# EAGLE design bottom-r1 (EAGLE 7.6.0)
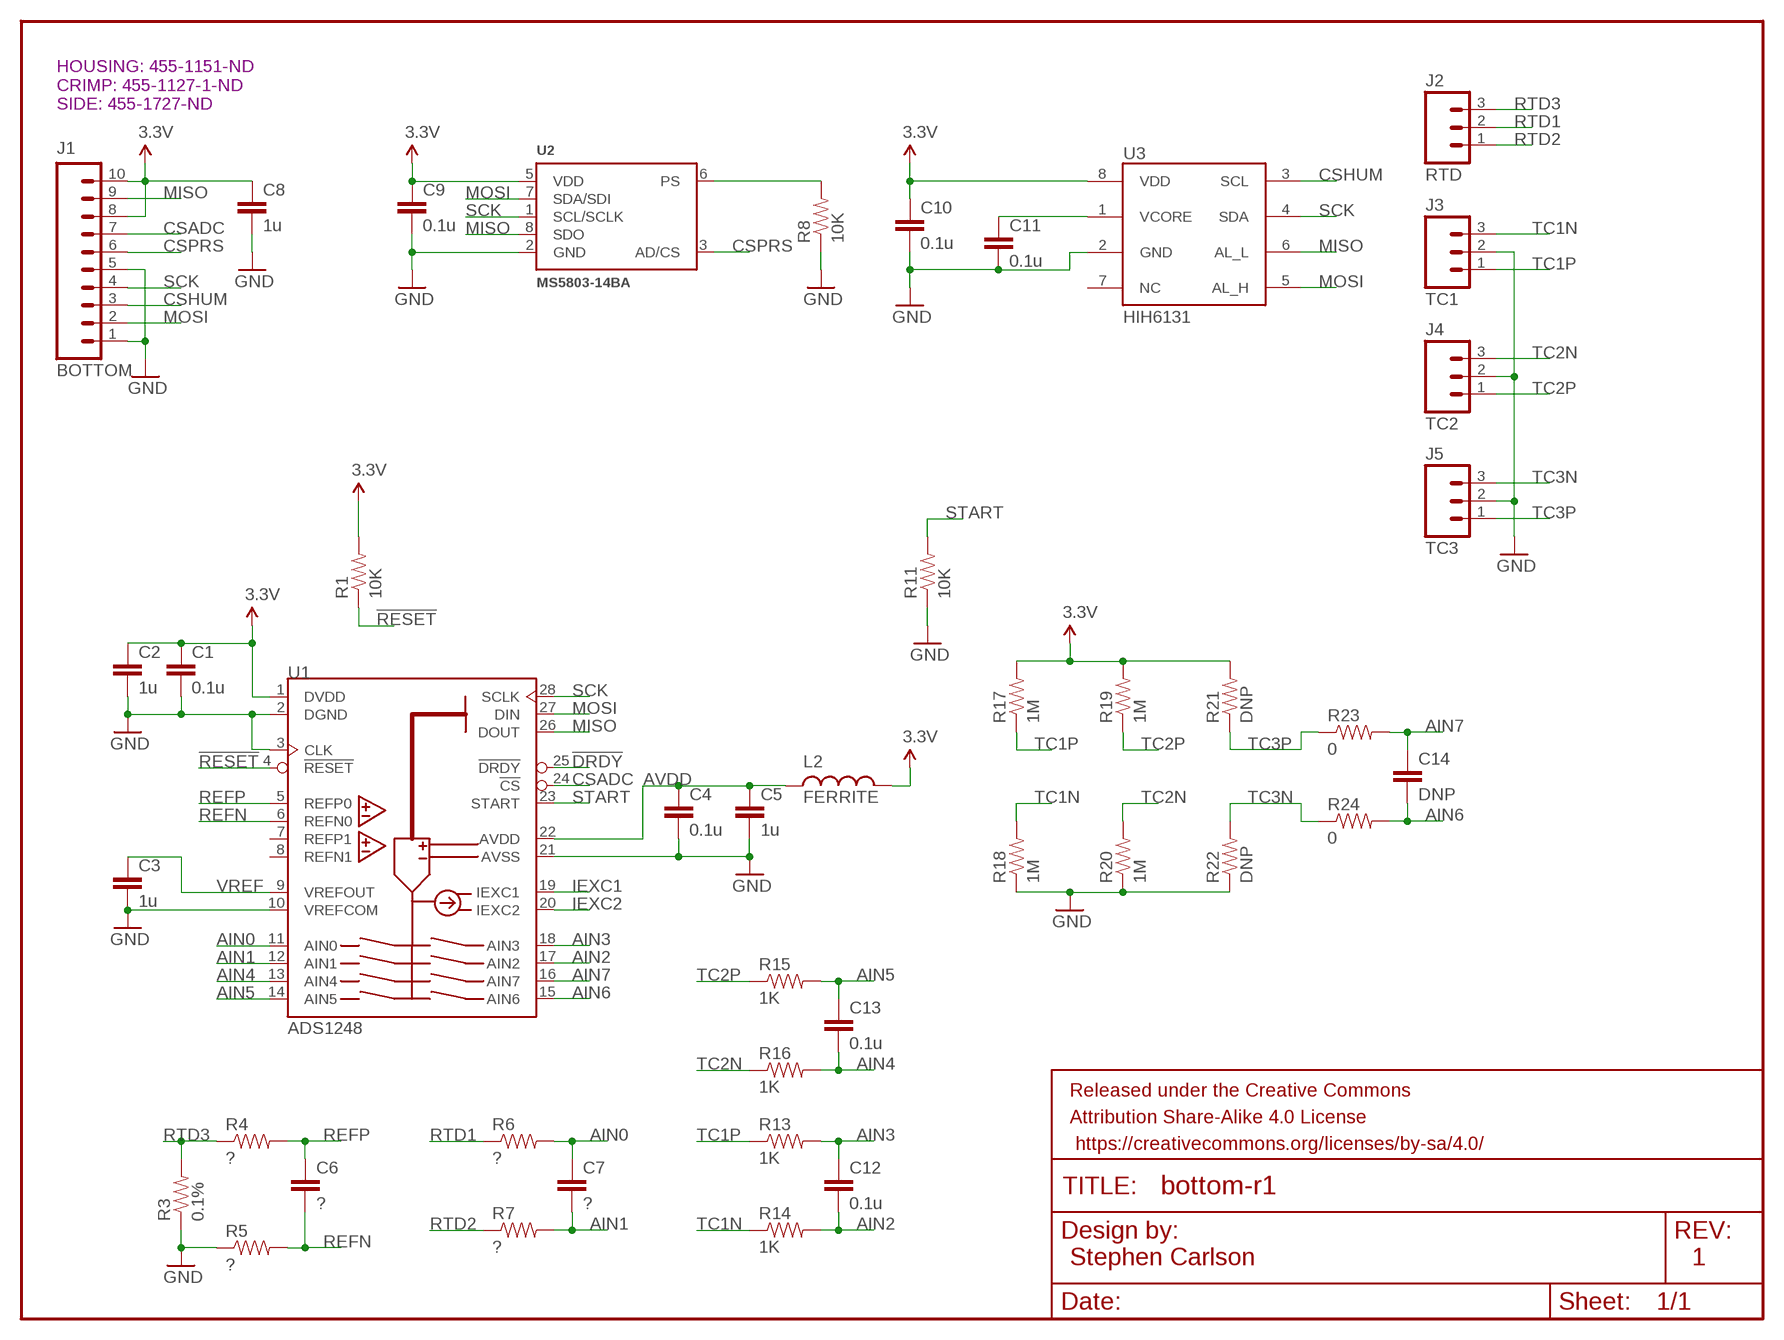
[diagram p0: schematic, sheet 1]

## Parts
C1  0.1u  CAP0805  [0805]
C2  1u  CAP0805  [0805]
C3  1u  CAP0805  [0805]
C4  0.1u  CAP0805  [0805]
C5  1u  CAP0805  [0805]
C6  ?  CAP0805  [0805]
C7  ?  CAP0805  [0805]
C8  1u  CAP0805  [0805]
C9  0.1u  CAP0805  [0805]
C10  0.1u  CAP0805  [0805]
C11  0.1u  CAP0805  [0805]
C12  0.1u  CAP0805  [0805]
C13  0.1u  CAP0805  [0805]
C14  DNP  CAP0805  [0805]
FRAME1  FRAME-LETTERNO_PACKAGE  [DUMMY]
J1  BOTTOM  M102MM  [1X10-2MM]
J2  RTD  M03JST-PTH  [JST-3-PTH]
J3  TC1  M03JST-PTH  [JST-3-PTH]
J4  TC2  M03JST-PTH  [JST-3-PTH]
J5  TC3  M03JST-PTH  [JST-3-PTH]
L2  FERRITE  INDUCTOR1206  [1206]
R1  10K  RESISTOR0805-RES  [0805]
R3  0.1%  RESISTOR0805-RES  [0805]
R4  ?  RESISTOR0805-RES  [0805]
R5  ?  RESISTOR0805-RES  [0805]
R6  ?  RESISTOR0805-RES  [0805]
R7  ?  RESISTOR0805-RES  [0805]
R8  10K  RESISTOR0805-RES  [0805]
R11  10K  RESISTOR0805-RES  [0805]
R13  1K  RESISTOR0805-RES  [0805]
R14  1K  RESISTOR0805-RES  [0805]
R15  1K  RESISTOR0805-RES  [0805]
R16  1K  RESISTOR0805-RES  [0805]
R17  1M  RESISTOR0805-RES  [0805]
R18  1M  RESISTOR0805-RES  [0805]
R19  1M  RESISTOR0805-RES  [0805]
R20  1M  RESISTOR0805-RES  [0805]
R21  DNP  RESISTOR0805-RES  [0805]
R22  DNP  RESISTOR0805-RES  [0805]
R23  0  RESISTOR0805-RES  [0805]
R24  0  RESISTOR0805-RES  [0805]
U1  ADS1248  [SO28]
U2  MS5803-14BA  [MS5803]
U3  HIH6131  [SOIC8]

## Nets
3.3V: C1.1 C2.1 C8.1 C9.1 C10.1 J1.8 J1.10 L2.2 R1.2 R17.2 R19.2 R21.2 U1.1(DVDD) U2.5(VDD) U3.8(VDD)
!DRDY!: U1.25(!DRDY!)
!RESET!: R1.1 U1.4(!RESET!)
AIN0: C7.1 R6.2 U1.11(AIN0)
AIN1: C7.2 R7.2 U1.12(AIN1)
AIN2: C12.2 R14.2 U1.17(AIN2)
AIN3: C12.1 R13.2 U1.18(AIN3)
AIN4: C13.2 R16.2 U1.13(AIN4)
AIN5: C13.1 R15.2 U1.14(AIN5)
AIN6: C14.2 R24.2 U1.15(AIN6)
AIN7: C14.1 R23.2 U1.16(AIN7)
AVDD: C4.1 C5.1 L2.1 U1.22(AVDD)
CSADC: J1.7 U1.24(!CS!)
CSHUM: J1.3 U3.3(SCL)
CSPRS: J1.6 U2.3(AD/CS)
GND: C1.2 C2.2 C3.2 C4.2 C5.2 C8.2 C9.2 C10.2 C11.2 J1.1 J1.5 J3.2 J4.2 J5.2 R3.1 R5.1 R8.1 R11.1 R18.1 R20.1 R22.1 U1.2(DGND) U1.3(CLK) U1.10(VREFCOM) U1.21(AVSS) U2.2(GND) U3.2(GND)
IEXC1: U1.19(IEXC1)
IEXC2: U1.20(IEXC2)
MISO: J1.9 U1.26(DOUT) U2.8(SDO) U3.6(AL_L)
MOSI: J1.2 U1.27(DIN) U2.7(SDA/SDI) U3.5(AL_H)
PS: R8.2 U2.6(PS)
REFN: C6.2 R5.2 U1.6(REFN0)
REFP: C6.1 R4.2 U1.5(REFP0)
RTD1: J2.2 R6.1
RTD2: J2.1 R7.1
RTD3: J2.3 R3.2 R4.1
SCK: J1.4 U1.28(SCLK) U2.1(SCL/SCLK) U3.4(SDA)
START: R11.2 U1.23(START)
TC1N: J3.3 R14.1 R18.2
TC1P: J3.1 R13.1 R17.1
TC2N: J4.3 R16.1 R20.2
TC2P: J4.1 R15.1 R19.1
TC3N: J5.3 R22.2 R24.1
TC3P: J5.1 R21.1 R23.1
VCORE: C11.1 U3.1(VCORE)
VREF: C3.1 U1.9(VREFOUT)
Unconnected: U1.7(REFP1) U1.8(REFN1) U3.7(NC)

## Notes on the sheet
- HOUSING: 455-1151-ND
  CRIMP: 455-1127-1-ND
  SIDE: 455-1727-ND
- Stephen Carlson | 1

## Library data of the parts
C1-C14 = SparkFun-Passives:CAP: Capacitor Standard 0603 ceramic capacitor, and 0.1" leaded capacitor.
FRAME1 = SparkFun-Aesthetics:FRAME-LETTER: Schematic Frame Standard 8.5x11 US Letter frame; DESIGNER: Nobody; VERSION: v01
J1 = SparkFun-Connectors:M10: Header 10 Standard 10-pin 0.1" header. Use with straight break away headers (SKU : PRT-00116), right angle break away headers (PRT-00553), swiss pins (PRT-00743), machine pins (PRT-00117), and female headers (PRT-00115).
J2-J5 = SparkFun-Connectors:M03: Header 3 Standard 3-pin 0.1" header. Use with straight break away headers (SKU : PRT-00116), right angle break away headers (PRT-00553), swiss pins (PRT-00743), machine pins (PRT-00117), and female headers (PRT-00115). Molex polarized connector foot print use with SKU : PRT-08232 with associated crimp pins and housings.; SKU: PRT-09915
L2 = HAB:INDUCTOR: INDUCTOR Standard inductor, with some new packages Why do inductors never come in standard packages!?
R1 R3-R8 R11 R13-R24 = SparkFun-Passives:RESISTOR: Resistor Basic schematic elements and footprints for 0603, 1206, and PTH resistors.
U1 = HAB:ADS1248: ADS1248 24-bit, 2-kSPS, Analog-To-Digital Converters with Programmable Gain Amplifier (PGA) for Sensor Measurement
U2 = SparkFun-Sensors:MS5803-14BA: Measurement Specialties MS5803_14BA Pressure (Depth) Sensor Datasheet: https://cdn.sparkfun.com/datasheets/Sensors/Weather/ms5803_14ba.pdf; PROD_ID: IC-12111
U3 = SparkFun-AnalogIC:HIH6131

## Board
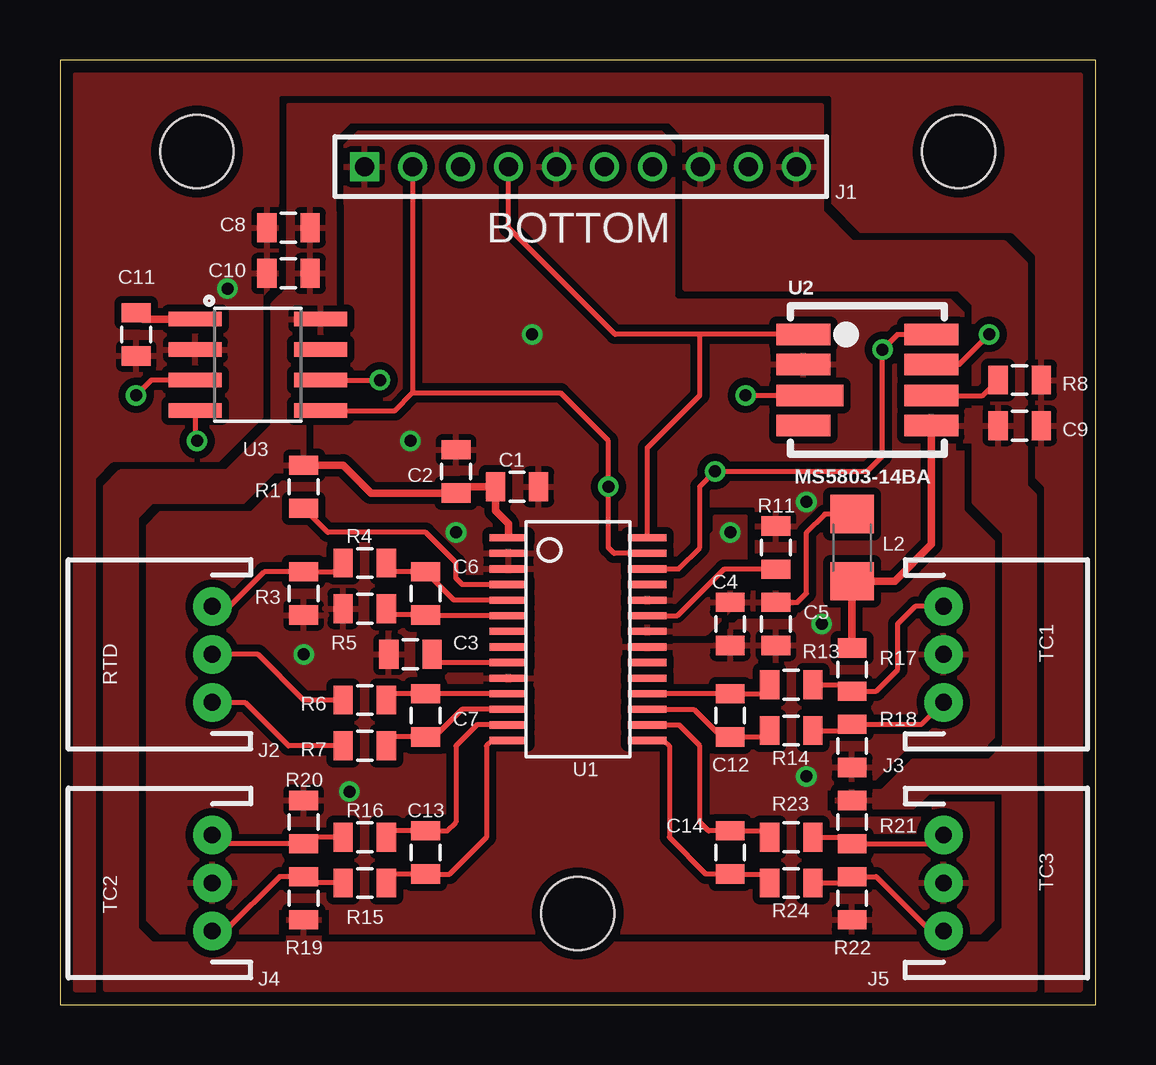
[diagram p1: board, top side]
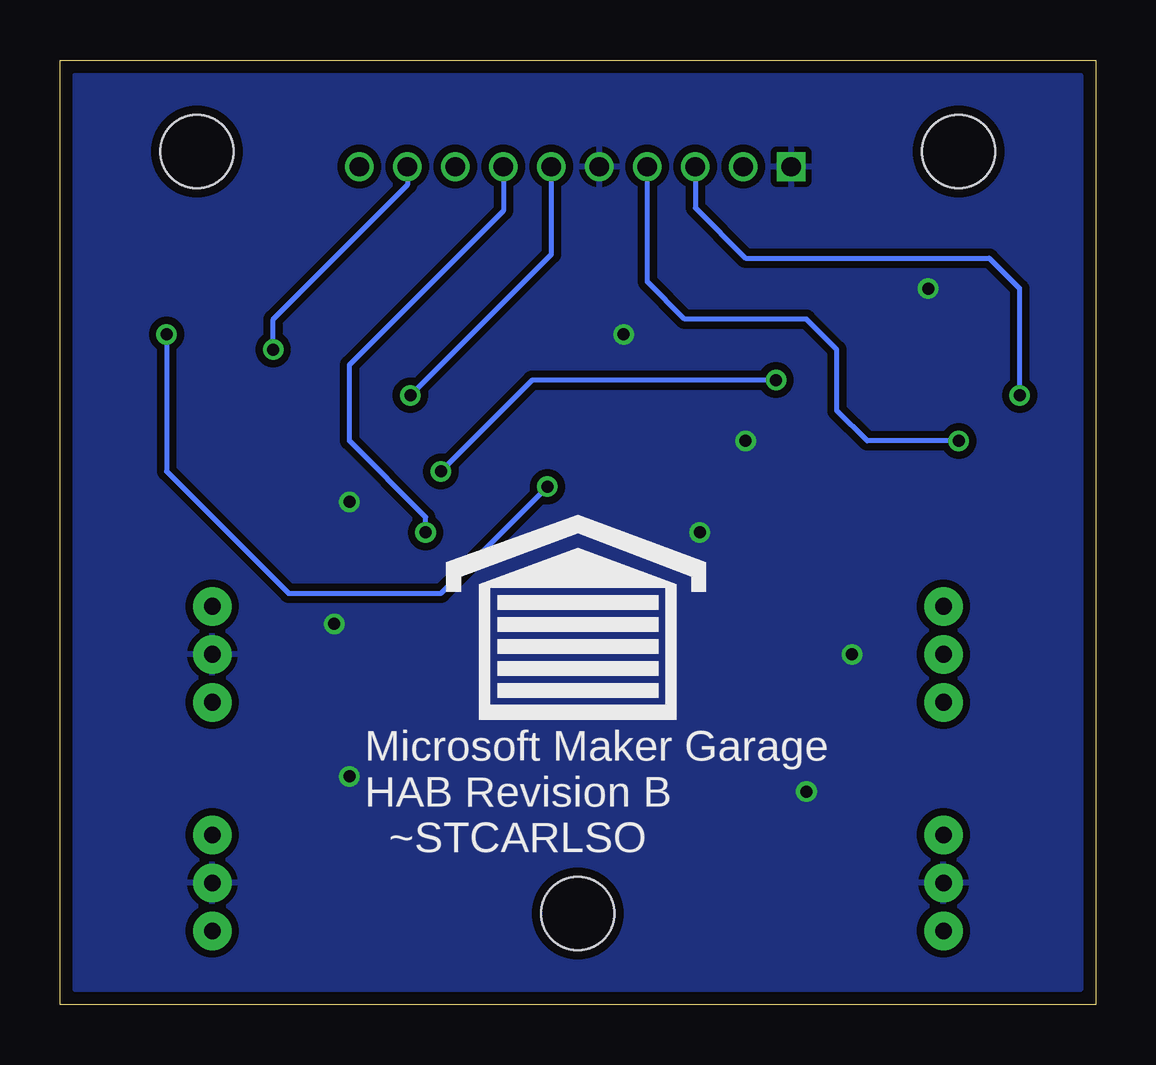
[diagram p2: board, bottom side, seen from below]

Size 43.18 x 39.37 mm. Coordinates in mm from the lower left corner, seen from the top.
Outline: 0,0 43.18,0 43.18,39.37 0,39.37 0,0
Copper layers (1*16): Top 0.0356mm / dielectric 1.5011mm / Bottom 0.0356mm
Design rules "LaenPCBOrder *": minimum track width 6mil, minimum drill 13mil, track to track 6mil, track to pad 6mil, pad to pad 6mil, via to via 6mil, smd to smd 6mil, copper to edge 15mil, drill to drill 6mil, minimum pad ring 7mil, minimum via ring 7mil, stop-mask expansion 3mil, vias tented up to drill 0mil, thermal gap 10mil
Holes 3.05 mm at 21.59,3.81 5.71,35.56 37.47,35.56

### Footprints (pad centres in the part's own frame; a part is rotated, then mirrored left to right if it is on the bottom)
0805 = smd 0.8 x 1.2: 1 -0.9,0; 2 0.9,0
1X10-2MM = drill 0.8 square: 1 0,0 | drill 0.8: 2 2,0; 3 4,0; 4 6,0; 5 8,0; 6 10,0; 7 12,0; 8 14,0; 9 16,0; 10 18,0
JST-3-PTH = drill 0.7 pad 1.6: 1 -2,0; 2 0,0; 3 2,0
1206 = smd 1.6 x 1.8: 1 -1.4,0; 2 1.4,0
SO28 = smd 0.3 x 1.6: 1 -4.225,-2.894; 2 -3.575,-2.894; 3 -2.925,-2.894; 4 -2.275,-2.894; 5 -1.625,-2.894; 6 -0.975,-2.894; 7 -0.325,-2.894; 8 0.325,-2.894; 9 0.975,-2.894; 10 1.625,-2.894; 11 2.275,-2.894; 12 2.925,-2.894; 13 3.575,-2.894; 14 4.225,-2.894; 15 4.225,2.894; 16 3.575,2.894; 17 2.925,2.894; 18 2.275,2.894; 19 1.625,2.894; 20 0.975,2.894; 21 0.325,2.894; 22 -0.325,2.894; 23 -0.975,2.894; 24 -1.625,2.894; 25 -2.275,2.894; 26 -2.925,2.894; 27 -3.575,2.894; 28 -4.225,2.894
MS5803 = smd 2.25 x 0.9: 1 -2.675,1.9; 2 -2.675,0.65; 4 -2.675,-1.9; 5 2.675,-1.9; 6 2.675,-0.65; 7 2.675,0.65; 8 2.675,1.9 | smd 2.8 x 0.9: 3 -2.4,-0.65
SOIC8 = smd 0.61 x 2.21: 1 -1.905,-2.616; 2 -0.635,-2.616; 3 0.635,-2.616; 4 1.905,-2.616; 5 1.905,2.616; 6 0.635,2.616; 7 -0.635,2.616; 8 -1.905,2.616

### Placement (x,y rotation side)
C1  19.05,21.59 0 top
C2  16.51,22.23 90 top
C3  14.61,14.61 180 top
C4  27.94,15.88 270 top
C5  29.84,15.88 270 top
C6  15.24,17.14 270 top
C7  15.24,12.06 270 top
C8  9.53,32.38 180 top
C9  40.01,24.13 0 top
C10  9.53,30.48 180 top
C11  3.17,27.94 270 top
C12  27.94,12.06 270 top
C13  15.24,6.35 90 top
C14  27.94,6.35 270 top
FRAME1  0,-1.27 0 top
J1  12.7,34.92 0 top
J2  6.35,14.61 90 top
J3  36.83,14.61 270 top
J4  6.35,5.08 90 top
J5  36.83,5.08 270 top
L2  33.02,19.05 270 top
R1  10.16,21.59 90 top
R3  10.16,17.14 90 top
R4  12.7,18.41 0 top
R5  12.7,16.51 0 top
R6  12.7,12.7 0 top
R7  12.7,10.79 0 top
R8  40.01,26.04 180 top
R11  29.84,19.05 270 top
R13  30.48,13.34 180 top
R14  30.48,11.43 180 top
R15  12.7,5.08 0 top
R16  12.7,6.99 0 top
R17  33.02,13.97 90 top
R18  33.02,10.79 90 top
R19  10.16,4.45 270 top
R20  10.16,7.62 270 top
R21  33.02,7.62 90 top
R22  33.02,4.45 90 top
R23  30.48,6.99 180 top
R24  30.48,5.08 180 top
U1  21.59,15.24 270 top
U2  33.66,26.04 0 top
U3  8.26,26.67 270 top
U$1  [GARAGE]  21.59,15.24 0 bottom

### Tracks (layer width: path | path; a pad name or v marks a point on that pad's centre or on a via)
3.3V
  Top 0.305: U1.1 18.7,20.04 18.15,20.59 C1.1 16.77,21.59 C2.1 12.96,21.32 11.8,22.49 R1.2 | R17.2 L2.2 34.8,17.65 36.33,19.18 U2.5
  pour Top (isolate 0.305, rank 2): 9.53,37.47 9.53,33.02 11.43,33.02 11.43,36.2 12.06,36.83 25.4,36.83 26.04,36.2 26.04,29.84 37.47,29.84 38.1,29.21 38.1,24.77 36.2,24.77 36.2,23.5 38.1,23.5 38.1,20.95 39.37,19.68 39.37,10.79 38.73,10.16 35.56,10.16 34.29,8.89 32.38,8.89 32.38,8.26 35.56,8.26 36.2,8.89 40.64,8.89 40.64,21.21 40.26,21.59 40.26,30.86 39.37,31.75 33.02,31.75 31.75,33.02 31.75,37.47
  pour Top (isolate 0.305, rank 2): 40.64,0.64 1.91,0.64 1.91,21.59 2.54,22.23 6.99,22.23 8.89,24.13 8.89,29.21 9.53,29.84 9.53,33.02 11.43,33.02 11.43,27.94 10.16,27.94 10.16,22.23 8.89,22.23 7.62,20.95 3.81,20.95 3.17,20.32 3.17,3.17 3.81,2.54 9.53,2.54 9.53,3.81 10.79,3.81 10.79,2.54 38.73,2.54 39.37,3.17 39.37,8.89 40.64,8.89
!RESET!
  Top 0.203: U1.4 16.77,17.52 16.51,17.78 16.51,18.41 15.24,19.68 11.16,19.68 R1.1
AIN0
  Top 0.203: U1.11 C7.1 13.87,12.96 R6.2
AIN1
  Top 0.203: U1.12 16.76,12.31 15.61,11.16 C7.2 13.97,11.16 R7.2
AIN2
  Top 0.203: R14.2 29.32,11.16 C12.2 27.57,11.16 26.42,12.31 U1.17
AIN3
  Top 0.203: R13.2 29.21,12.96 C12.1 U1.18
AIN4
  Top 0.203: U1.13 17.38,11.66 16.51,10.79 16.51,7.62 16.14,7.25 C13.2 13.87,7.25 R16.2
AIN5
  Top 0.203: R15.2 13.97,5.45 C13.1 16.25,5.45 17.78,6.99 17.78,10.79 18,11.02 U1.14
AIN6
  Top 0.203: R24.2 29.21,5.45 C14.2 26.93,5.45 25.4,6.99 25.4,10.79 25.18,11.02 U1.15
AIN7
  Top 0.203: R23.2 29.32,7.25 C14.1 27.04,7.25 26.67,7.62 26.67,10.79 25.8,11.66 U1.16
AVDD
  Top 0.203: C5.1 30.75,16.77 31.11,17.14 31.11,19.68 31.88,20.45 L2.1
  pour Top (isolate 0.203, rank 2): 24.13,15.88 24.13,15.49 26.92,15.49 27.94,16.51 30.48,16.51 30.48,17.14 26.67,17.14 25.4,15.88
CSADC  (via drill 0.5)
  Bottom 0.203: v27.94,19.68 27.94,20.32 31.11,23.5 31.11,26.67 24.7,33.09 J1.7
  pour Top (isolate 0.305): 24.13,17.14 24.13,16.51 25.4,16.51 27.3,18.41 28.57,18.41 28.57,20.32 27.3,20.32 27.3,19.68 24.77,17.14
CSHUM  (via drill 0.5)
  Top 0.203: U3.3 3.81,26.04 v3.17,25.4
  Bottom 0.203: J1.3 16.7,33.21 14.61,31.11 4.45,31.11 3.17,29.84 v3.17,25.4
CSPRS  (via drill 0.5)
  Top 0.203: U2.3 28.59,25.39 v28.57,25.4
  Bottom 0.203: v28.57,25.4 22.7,31.27 J1.6
GND  (via drill 0.5)
  other vias: 10.16,14.61 14.61,23.5 31.75,15.88 31.11,9.53 31.11,20.95 19.68,27.94 12.06,8.89 6.99,29.84 16.51,19.68
  pour Bottom (isolate 0.305, rank 3): 0.64,38.73 0.64,0.64 42.55,0.64 42.55,38.73
  pour Top (isolate 0.305, rank 3): 0.64,38.73 0.64,0.64 42.55,0.64 42.55,38.73
MISO  (via drill 0.5)
  Top 0.203: U1.26 25.79,18.16 26.67,19.05 26.67,21.59 v27.3,22.23 29.21,22.23 33.66,22.23 34.29,22.86 v34.29,27.3 34.92,27.94 U2.8 | U3.6 v13.34,26.04
  Bottom 0.203: v34.29,27.3 34.29,28.57 28.7,34.16 J1.9 | v13.34,26.04 23.5,26.04 v27.3,22.23
MOSI  (via drill 0.5)
  Top 0.203: U1.27 23.09,18.82 22.86,19.05 v22.86,21.59 22.86,23.5 20.86,25.5 14.7,25.5 | U3.5 13.97,24.77 14.7,25.5 | J1.2 14.7,25.5 | U2.7 37.48,26.68 v38.73,27.94
  Bottom 0.203: v38.73,27.94 38.73,22.23 33.66,17.14 27.3,17.14 v22.86,21.59
PS
  Top 0.203: U2.6 38.45,25.39 R8.2
REFN
  Top 0.203: R5.2 13.87,16.25 C6.2 15.27,16.21 U1.6
REFP
  Top 0.203: R4.2 13.97,18.05 C6.1 16.42,16.86 U1.5
RTD1
  Top 0.203: R6.1 10.16,12.7 8.26,14.61 J2.2
RTD2
  Top 0.203: R7.1 9.53,10.79 7.71,12.61 J2.1
RTD3
  Top 0.203: J2.3 7.08,16.61 8.52,18.05 R3.2 11.43,18.05 R4.1
SCK  (via drill 0.5)
  Top 0.203: U1.28 24.48,23.21 26.67,25.4 26.67,27.94 | U2.1 26.67,27.94 | U3.4 5.64,23.57 v5.71,23.5 | 26.67,27.94 23.14,27.94 18.7,32.38 J1.4
  Bottom 0.203: J1.4 18.7,30.13 17.14,28.57 12.06,28.57 10.79,27.3 10.79,24.77 9.53,23.5 v5.71,23.5
START
  Top 0.203: U1.23 25.74,16.21 27.68,18.15 R11.2
TC1N
  Top 0.203: J3.3 35.92,11.7 R18.2 32.76,11.43 R14.1
TC1P
  Top 0.203: J3.1 35.66,16.61 34.92,15.88 34.92,13.97 34.02,13.07 R17.1 32.76,13.34 R13.1
TC2N
  Top 0.203: R16.1 10.43,6.99 R20.2 6.71,6.72 J4.3
TC2P
  Top 0.203: R15.1 10.43,5.08 R19.1 9.15,5.34 6.89,3.08 J4.1
TC3N
  Top 0.203: R24.1 32.76,5.08 R22.2 34.02,5.34 36.29,3.08 J5.3
TC3P
  Top 0.203: R23.1 32.76,6.99 R21.1 36.47,6.72 J5.1
VCORE
  Top 0.305: U3.1 3.44,28.57 C11.1
VREF
  Top 0.203: U1.9 15.85,14.27 C3.1

### Text on the board
bPlace: Microsoft Maker Garage / HAB Revision B / ~STCARLSO